# Altium project 四位一体数码管.PrjPCB
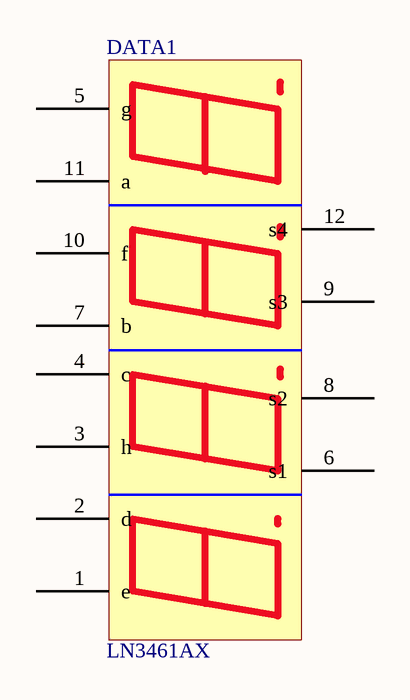
[diagram p0: 四位一体数码管.SchDoc]
1 sheet, 1 parts. Net scope: global (net labels, ports and power ports of the same name join across sheets).
Board file: 四位一体数码管.PcbDoc

## Sheet 四位一体数码管.SchDoc
size A4

### Parts
DATA1  LN3461AX  [DIP12:DISP2]

### Nets

Not connected (* = marked no-connect by the designer): DATA1 1(e) 2(d) 3(h) 4(c) 5(g) 6(s1) 7(b) 8(s2) 9(s3) 10(f) 11(a) 12(s4)

### Library data of the parts
DATA1 = DATA04: data?